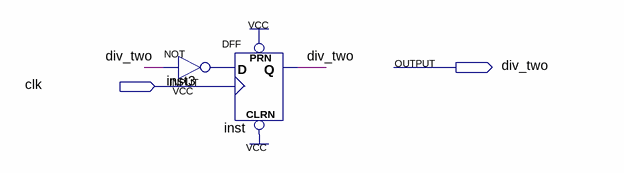
[diagram p0: schematic sheet]
// Quartus schematic clk_pixel.bdf as structural Verilog: 2 symbols, 2 pins
module clk_pixel (
  input  clk,
  output div_two
);

  wire inst3_out;

  DFF inst (.CLRN(1'b1), .CLK(clk), .D(inst3_out), .PRN(1'b1), .Q(div_two));
  not inst3 (inst3_out, div_two);
endmodule
